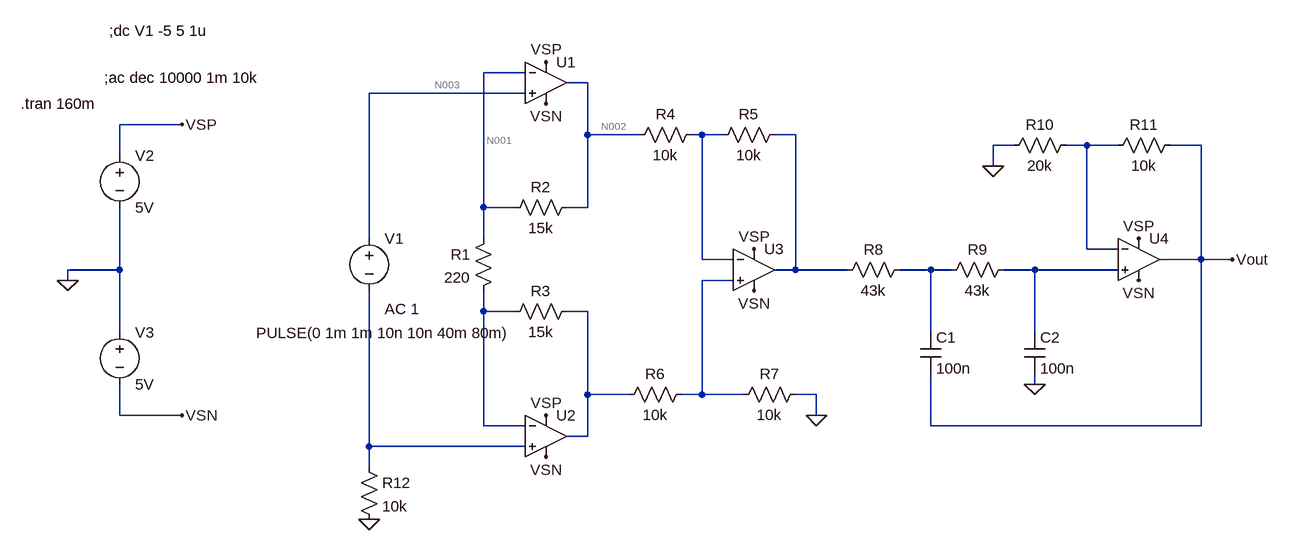
[diagram p0: schematic DEEA-tema.asc]
DEEA-tema.asc, the LTspice schematic file:
Version 4
SHEET 1 1304 804
WIRE 144 96 80 96
WIRE 240 112 208 112
WIRE 144 128 -96 128
WIRE -384 176 -480 176
WIRE 240 192 240 112
WIRE 320 192 240 192
WIRE 416 192 400 192
WIRE 448 192 416 192
WIRE 560 192 528 192
WIRE 896 208 864 208
WIRE 1008 208 976 208
WIRE 1056 208 1008 208
WIRE 1184 208 1136 208
WIRE -480 224 -480 176
WIRE 864 240 864 208
WIRE 80 304 80 96
WIRE 128 304 80 304
WIRE 240 304 240 192
WIRE 240 304 208 304
WIRE -96 352 -96 128
WIRE 80 352 80 304
WIRE 1008 368 1008 208
WIRE 1056 368 1008 368
WIRE 416 384 416 192
WIRE 464 384 416 384
WIRE 1184 384 1184 208
WIRE 1184 384 1120 384
WIRE 1232 384 1184 384
WIRE -480 400 -480 304
WIRE -480 400 -560 400
WIRE 560 400 560 192
WIRE 560 400 528 400
WIRE 640 400 560 400
WIRE 768 400 720 400
WIRE 800 400 768 400
WIRE 928 400 880 400
WIRE 1056 400 928 400
WIRE -560 416 -560 400
WIRE 464 416 416 416
WIRE 80 464 80 432
WIRE 128 464 80 464
WIRE 240 464 208 464
WIRE -480 496 -480 400
WIRE 768 496 768 400
WIRE 928 496 928 400
WIRE 928 576 928 560
WIRE 240 592 240 464
WIRE 304 592 240 592
WIRE 416 592 416 416
WIRE 416 592 384 592
WIRE 480 592 416 592
WIRE 592 592 560 592
WIRE -480 624 -480 576
WIRE -384 624 -480 624
WIRE 592 624 592 592
WIRE 80 640 80 464
WIRE 144 640 80 640
WIRE 768 640 768 560
WIRE 1184 640 1184 384
WIRE 1184 640 768 640
WIRE 240 656 240 592
WIRE 240 656 208 656
WIRE -96 672 -96 432
WIRE 144 672 -96 672
WIRE -96 704 -96 672
FLAG 592 624 0
FLAG 928 576 0
FLAG 864 240 0
FLAG -96 784 0
FLAG -560 416 0
FLAG 176 80 VSP
FLAG 176 624 VSP
FLAG 496 368 VSP
FLAG 1088 352 VSP
FLAG -384 176 VSP
FLAG 176 144 VSN
FLAG 176 688 VSN
FLAG 496 432 VSN
FLAG 1088 416 VSN
FLAG -384 624 VSN
FLAG 1232 384 Vout
SYMBOL OpAmps\\UniversalOpAmp2 176 112 R0
SYMATTR InstName U1
SYMBOL OpAmps\\UniversalOpAmp2 176 656 R0
SYMATTR InstName U2
SYMBOL res 96 336 M0
SYMATTR InstName R1
SYMATTR Value 220
SYMBOL res 224 288 R90
WINDOW 0 0 56 VBottom 2
WINDOW 3 32 56 VTop 2
SYMATTR InstName R2
SYMATTR Value 15k
SYMBOL res 224 448 R90
WINDOW 0 0 56 VBottom 2
WINDOW 3 32 56 VTop 2
SYMATTR InstName R3
SYMATTR Value 15k
SYMBOL res 416 176 R90
WINDOW 0 0 56 VBottom 2
WINDOW 3 32 56 VTop 2
SYMATTR InstName R4
SYMATTR Value 10k
SYMBOL res 544 176 R90
WINDOW 0 0 56 VBottom 2
WINDOW 3 32 56 VTop 2
SYMATTR InstName R5
SYMATTR Value 10k
SYMBOL OpAmps\\UniversalOpAmp2 496 400 R0
SYMATTR InstName U3
SYMBOL res 400 576 R90
WINDOW 0 0 56 VBottom 2
WINDOW 3 32 56 VTop 2
SYMATTR InstName R6
SYMATTR Value 10k
SYMBOL res 576 576 R90
WINDOW 0 0 56 VBottom 2
WINDOW 3 32 56 VTop 2
SYMATTR InstName R7
SYMATTR Value 10k
SYMBOL res 736 384 R90
WINDOW 0 0 56 VBottom 2
WINDOW 3 32 56 VTop 2
SYMATTR InstName R8
SYMATTR Value 43k
SYMBOL res 896 384 R90
WINDOW 0 0 56 VBottom 2
WINDOW 3 32 56 VTop 2
SYMATTR InstName R9
SYMATTR Value 43k
SYMBOL cap 752 496 R0
SYMATTR InstName C1
SYMATTR Value 100n
SYMBOL cap 912 496 R0
SYMATTR InstName C2
SYMATTR Value 100n
SYMBOL OpAmps\\UniversalOpAmp2 1088 384 R0
SYMATTR InstName U4
SYMBOL res 992 192 R90
WINDOW 0 0 56 VBottom 2
WINDOW 3 32 56 VTop 2
SYMATTR InstName R10
SYMATTR Value 20k
SYMBOL res 1152 192 R90
WINDOW 0 0 56 VBottom 2
WINDOW 3 32 56 VTop 2
SYMATTR InstName R11
SYMATTR Value 10k
SYMBOL voltage -96 336 R0
WINDOW 3 -174 161 Left 2
WINDOW 123 24 124 Left 2
WINDOW 39 0 0 Left 0
SYMATTR Value PULSE(0 1m 1m 10n 10n 40m 80m)
SYMATTR Value2 AC 1
SYMATTR InstName V1
SYMBOL res -112 688 R0
SYMATTR InstName R12
SYMATTR Value 10k
SYMBOL voltage -480 208 R0
WINDOW 123 0 0 Left 0
WINDOW 39 0 0 Left 0
SYMATTR InstName V2
SYMATTR Value 5V
SYMBOL voltage -480 480 R0
WINDOW 123 0 0 Left 0
WINDOW 39 0 0 Left 0
SYMATTR InstName V3
SYMATTR Value 5V
TEXT -496 32 Left 2 !;dc V1 -5 5 1u
TEXT -504 104 Left 2 !;ac dec 10000 1m 10k
TEXT -632 144 Left 2 !.tran 160m

The netlist it stands for:
* DEEA-tema.asc
XU1 N003 N001 VSP VSN N002 level2 Avol=1Meg GBW=10Meg Slew=10Meg Ilimit=25m Rail=0 Vos=0 En=0 Enk=0 In=0 Ink=0 Rin=500Meg  ; pins In+ In- V+ V- OUT
XU2 N012 N010 VSP VSN N011 level2 Avol=1Meg GBW=10Meg Slew=10Meg Ilimit=25m Rail=0 Vos=0 En=0 Enk=0 In=0 Ink=0 Rin=500Meg  ; pins In+ In- V+ V- OUT
R1 N001 N010 220
R2 N002 N001 15k
R3 N011 N010 15k
R4 N004 N002 10k
R5 N005 N004 10k
XU3 N009 N004 VSP VSN N005 level2 Avol=1Meg GBW=10Meg Slew=10Meg Ilimit=25m Rail=0 Vos=0 En=0 Enk=0 In=0 Ink=0 Rin=500Meg  ; pins In+ In- V+ V- OUT
R6 N009 N011 10k
R7 0 N009 10k
R8 N007 N005 43k
R9 N008 N007 43k
C1 N007 Vout 100n
C2 N008 0 100n
XU4 N008 N006 VSP VSN Vout level2 Avol=1Meg GBW=10Meg Slew=10Meg Ilimit=25m Rail=0 Vos=0 En=0 Enk=0 In=0 Ink=0 Rin=500Meg  ; pins In+ In- V+ V- OUT
R10 N006 0 20k
R11 Vout N006 10k
V1 N003 N012 PULSE(0 1m 1m 10n 10n 40m 80m) AC 1
R12 N012 0 10k
V2 VSP 0 5V
V3 0 VSN 5V
;dc V1 -5 5 1u
;ac dec 10000 1m 10k
.tran 160m
.lib UniversalOpAmp2.lib
.backanno
.end

* Results of the author's LTspice run, read from the files saved beside the schematic
* Operating Point, zero values left out:
*   V(vsp) = 5 V
*   V(vsn) = -5 V
*   I(V2) = -2 mA
*   I(V3) = -2 mA
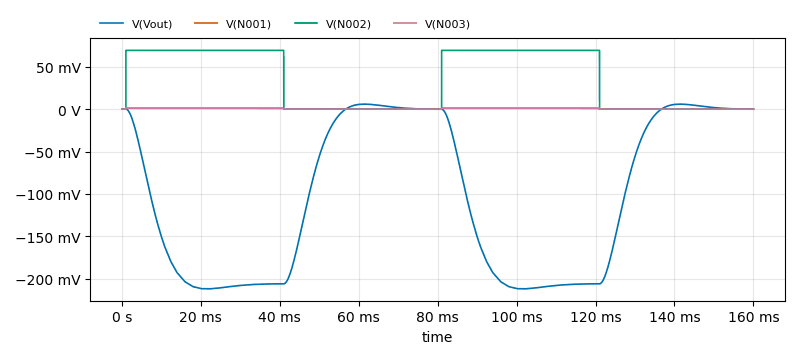
[diagram p1: Transient Analysis of DEEA-tema.asc, plotted from the saved traces]
* Transient Analysis, 1 run:
*   V(Vout): min -211.7 mV, max 5.841 mV, average -102.9 mV, rms 138.9 mV, last -147.4 µV
*   V(N001): min -889.7 nV, max 999.9 µV, average 500 µV, rms 707 µV, last -622.6 pV
*   V(N002): min -122.3 µV, max 69.17 mV, average 34.59 mV, rms 48.91 mV, last 0 V
*   V(N003): min 0 V, max 1 mV, average 500 µV, rms 707.1 µV, last 0 V